# Altium project merci_finger.PrjPcb
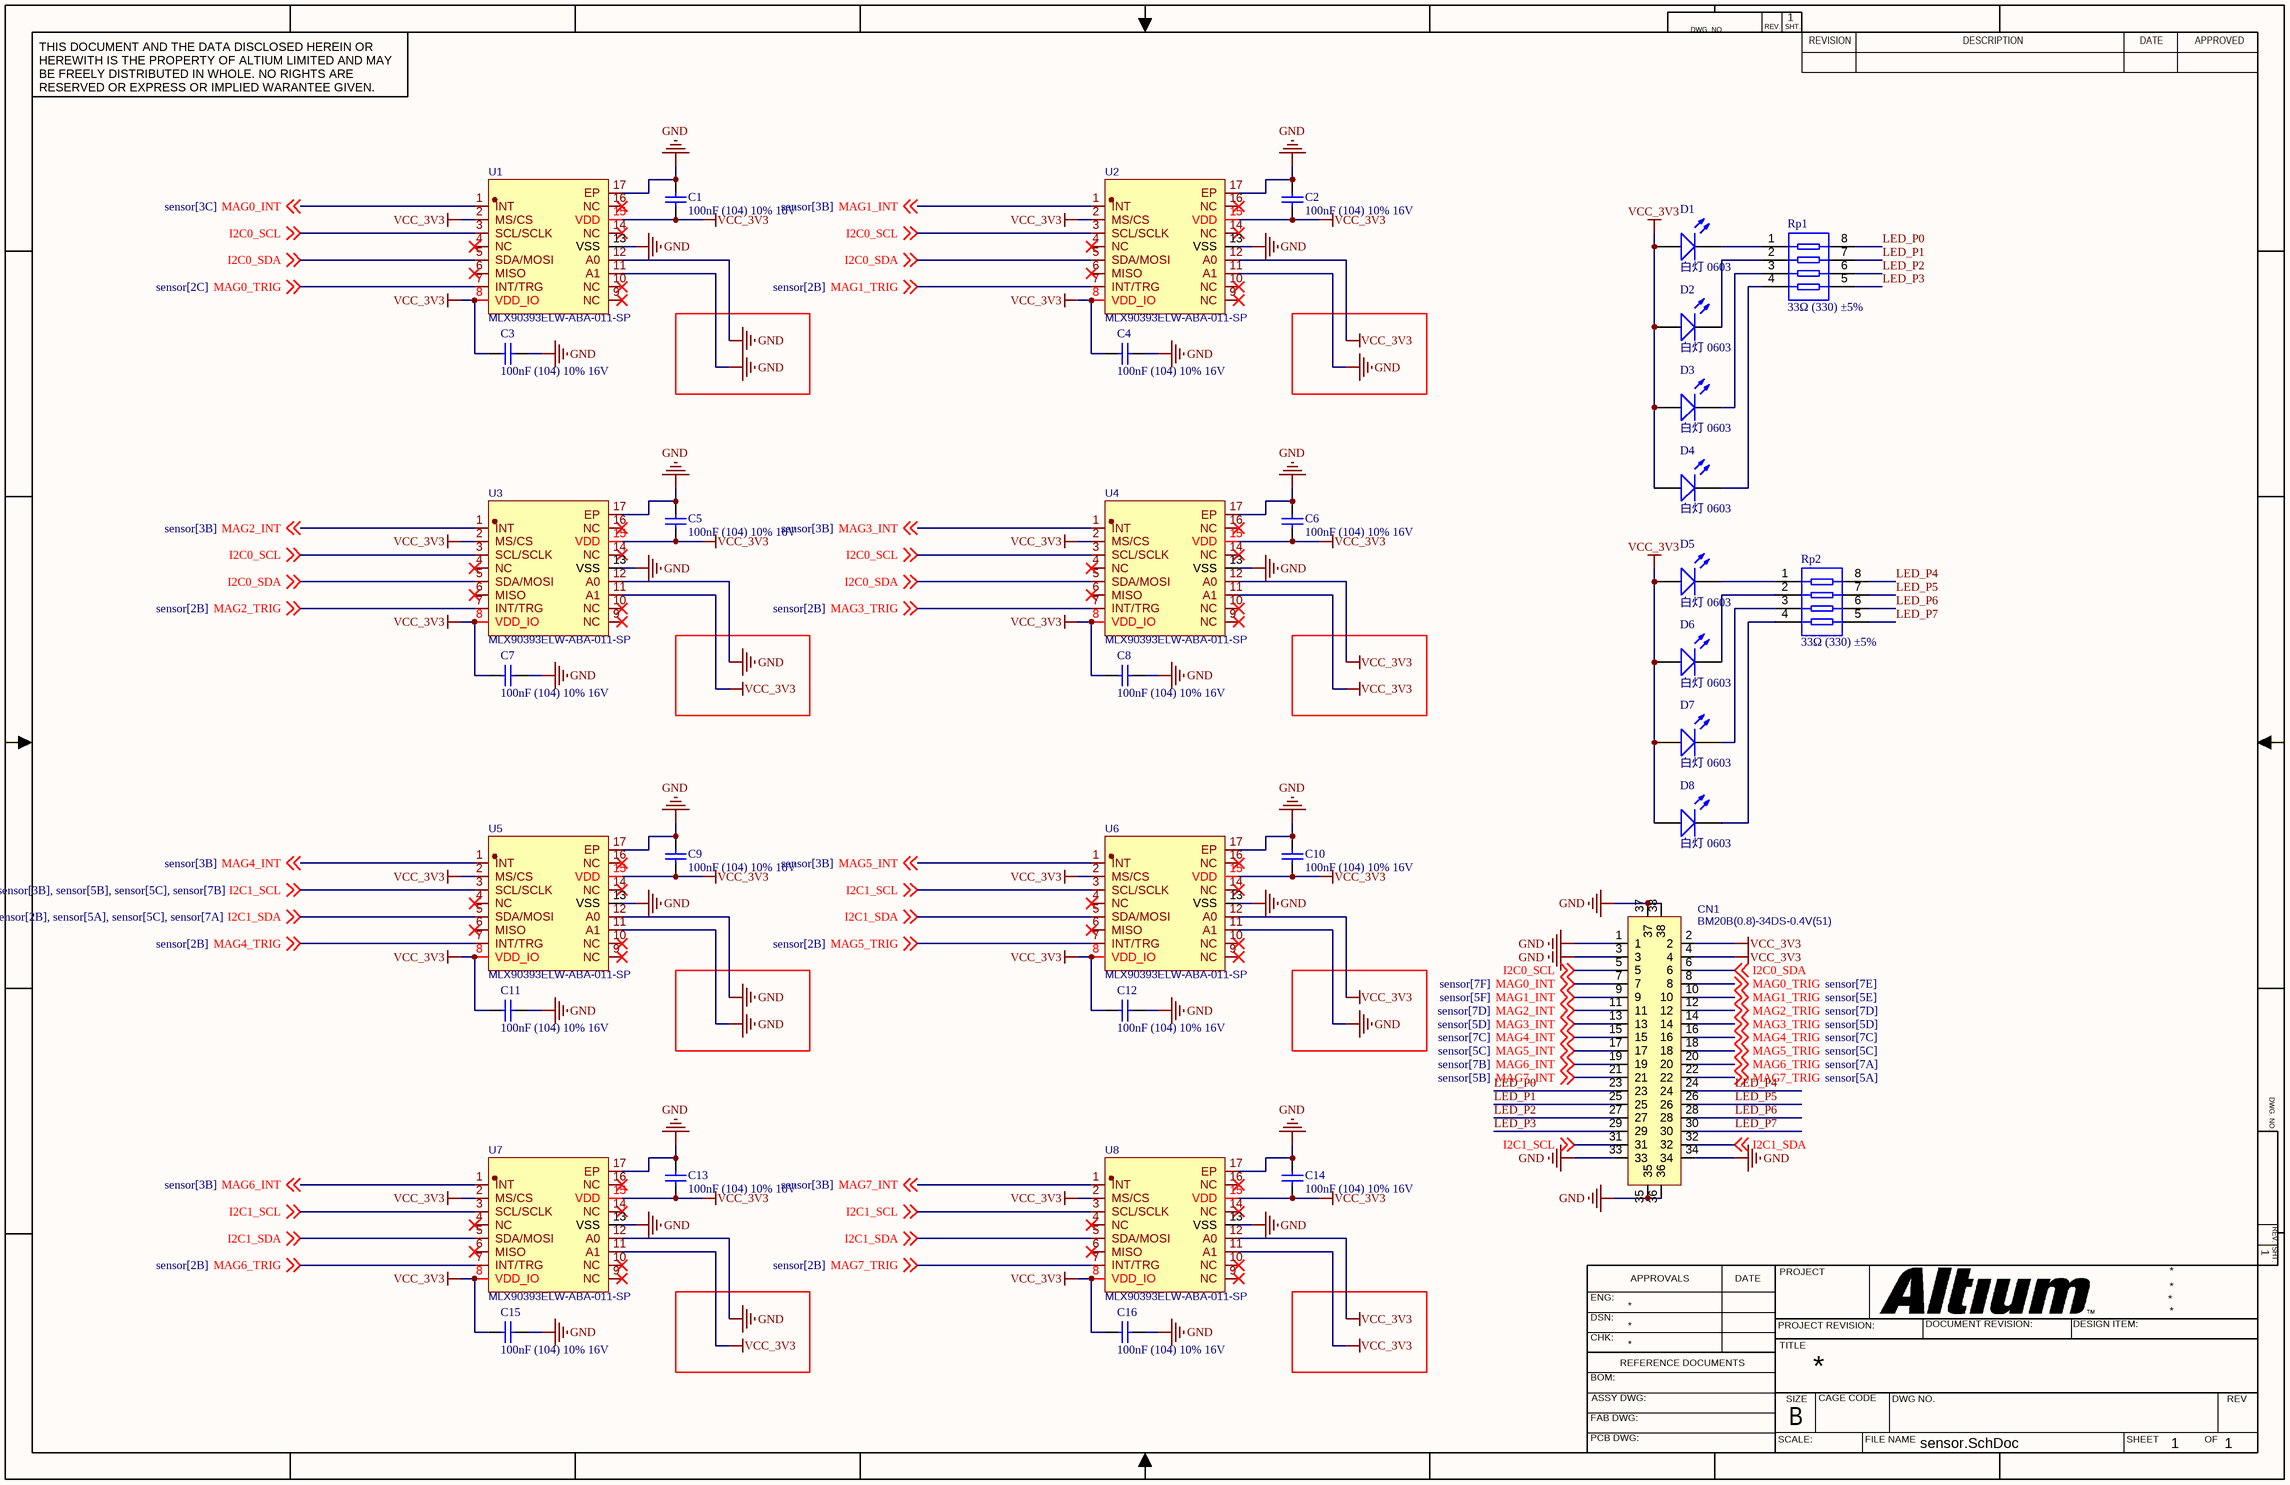
[diagram p0: sensor.SchDoc]
1 sheet, 35 parts. Net scope: global (net labels, ports and power ports of the same name join across sheets).
Board file: finger.PcbDoc

## Sheet sensor.SchDoc
size 431 x 279 mm; SheetNumber: 1; SheetTotal: 1

### Parts
C1  100nF (104) 10% 16V  [LC-0402_C_NOSILK]
C2  100nF (104) 10% 16V  [LC-0402_C_NOSILK]
C3  100nF (104) 10% 16V  [LC-0402_C_NOSILK]
C4  100nF (104) 10% 16V  [LC-0402_C_NOSILK]
C5  100nF (104) 10% 16V  [LC-0402_C_NOSILK]
C6  100nF (104) 10% 16V  [LC-0402_C_NOSILK]
C7  100nF (104) 10% 16V  [LC-0402_C_NOSILK]
C8  100nF (104) 10% 16V  [LC-0402_C_NOSILK]
C9  100nF (104) 10% 16V  [LC-0402_C_NOSILK]
C10  100nF (104) 10% 16V  [LC-0402_C_NOSILK]
C11  100nF (104) 10% 16V  [LC-0402_C_NOSILK]
C12  100nF (104) 10% 16V  [LC-0402_C_NOSILK]
C13  100nF (104) 10% 16V  [LC-0402_C_NOSILK]
C14  100nF (104) 10% 16V  [LC-0402_C_NOSILK]
C15  100nF (104) 10% 16V  [LC-0402_C_NOSILK]
C16  100nF (104) 10% 16V  [LC-0402_C_NOSILK]
CN1  BM20B(0.8)-34DS-0.4V(51)  [CONN-SMD_34P-P0.40_BM20B-0.8-34DS-0.4V-51]
D1  白灯 0603  [0603_LED_S1]
D2  白灯 0603  [0603_LED_S1]
D3  白灯 0603  [0603_LED_S1]
D4  白灯 0603  [0603_LED_S1]
D5  白灯 0603  [0603_LED_S1]
D6  白灯 0603  [0603_LED_S1]
D7  白灯 0603  [0603_LED_S1]
D8  白灯 0603  [0603_LED_S1]
Rp1  33Ω (330) ±5%  [0402_Rx4]
Rp2  33Ω (330) ±5%  [0402_Rx4]
U1  MLX90393ELW-ABA-011-SP  [QFN-16_L3.0-W3.0-P0.50-TR-EP1.7]
U2  MLX90393ELW-ABA-011-SP  [QFN-16_L3.0-W3.0-P0.50-TR-EP1.7]
U3  MLX90393ELW-ABA-011-SP  [QFN-16_L3.0-W3.0-P0.50-TR-EP1.7]
U4  MLX90393ELW-ABA-011-SP  [QFN-16_L3.0-W3.0-P0.50-TR-EP1.7]
U5  MLX90393ELW-ABA-011-SP  [QFN-16_L3.0-W3.0-P0.50-TR-EP1.7]
U6  MLX90393ELW-ABA-011-SP  [QFN-16_L3.0-W3.0-P0.50-TR-EP1.7]
U7  MLX90393ELW-ABA-011-SP  [QFN-16_L3.0-W3.0-P0.50-TR-EP1.7]
U8  MLX90393ELW-ABA-011-SP  [QFN-16_L3.0-W3.0-P0.50-TR-EP1.7]

### Nets
GND: C1.2 C2.2 C3.2 C4.2 C5.2 C6.2 C7.2 C8.2 C9.2 C10.2 C11.2 C12.2 C13.2 C14.2 C15.2 C16.2 CN1.1 CN1.3 CN1.33 CN1.34 CN1.35 CN1.36 CN1.37 CN1.38 U1.11(A1) U1.12(A0) U1.13(VSS) U1.17(EP) U2.11(A1) U2.13(VSS) U2.17(EP) U3.12(A0) U3.13(VSS) U3.17(EP) U4.13(VSS) U4.17(EP) U5.11(A1) U5.12(A0) U5.13(VSS) U5.17(EP) U6.11(A1) U6.13(VSS) U6.17(EP) U7.12(A0) U7.13(VSS) U7.17(EP) U8.13(VSS) U8.17(EP)
VCC_3V3: C1.1 C2.1 C3.1 C4.1 C5.1 C6.1 C7.1 C8.1 C9.1 C10.1 C11.1 C12.1 C13.1 C14.1 C15.1 C16.1 CN1.2 CN1.4 D1.A D2.A D3.A D4.A D5.A D6.A D7.A D8.A U1.2(MS/CS) U1.8(VDD_IO) U1.15(VDD) U2.2(MS/CS) U2.8(VDD_IO) U2.12(A0) U2.15(VDD) U3.2(MS/CS) U3.8(VDD_IO) U3.11(A1) U3.15(VDD) U4.2(MS/CS) U4.8(VDD_IO) U4.11(A1) U4.12(A0) U4.15(VDD) U5.2(MS/CS) U5.8(VDD_IO) U5.15(VDD) U6.2(MS/CS) U6.8(VDD_IO) U6.12(A0) U6.15(VDD) U7.2(MS/CS) U7.8(VDD_IO) U7.11(A1) U7.15(VDD) U8.2(MS/CS) U8.8(VDD_IO) U8.11(A1) U8.12(A0) U8.15(VDD)
I2C0_SCL: CN1.5 U1.3(SCL/SCLK) U2.3(SCL/SCLK) U3.3(SCL/SCLK) U4.3(SCL/SCLK) ; off-sheet I2C0_SCL
I2C0_SDA: CN1.6 U1.5(SDA/MOSI) U2.5(SDA/MOSI) U3.5(SDA/MOSI) U4.5(SDA/MOSI) ; off-sheet I2C0_SDA
I2C1_SCL: CN1.31 U5.3(SCL/SCLK) U6.3(SCL/SCLK) U7.3(SCL/SCLK) U8.3(SCL/SCLK) ; off-sheet I2C1_SCL
I2C1_SDA: CN1.32 U5.5(SDA/MOSI) U6.5(SDA/MOSI) U7.5(SDA/MOSI) U8.5(SDA/MOSI) ; off-sheet I2C1_SDA
LED_P0: CN1.23 Rp1.8
LED_P1: CN1.25 Rp1.7
LED_P2: CN1.27 Rp1.6
LED_P3: CN1.29 Rp1.5
LED_P4: CN1.24 Rp2.8
LED_P5: CN1.26 Rp2.7
LED_P6: CN1.28 Rp2.6
LED_P7: CN1.30 Rp2.5
MAG0_INT: CN1.7 U1.1(INT) ; off-sheet MAG0_INT
MAG0_TRIG: CN1.8 U1.7(INT/TRG) ; off-sheet MAG0_TRIG
MAG1_INT: CN1.9 U2.1(INT) ; off-sheet MAG1_INT
MAG1_TRIG: CN1.10 U2.7(INT/TRG) ; off-sheet MAG1_TRIG
MAG2_INT: CN1.11 U3.1(INT) ; off-sheet MAG2_INT
MAG2_TRIG: CN1.12 U3.7(INT/TRG) ; off-sheet MAG2_TRIG
MAG3_INT: CN1.13 U4.1(INT) ; off-sheet MAG3_INT
MAG3_TRIG: CN1.14 U4.7(INT/TRG) ; off-sheet MAG3_TRIG
MAG4_INT: CN1.15 U5.1(INT) ; off-sheet MAG4_INT
MAG4_TRIG: CN1.16 U5.7(INT/TRG) ; off-sheet MAG4_TRIG
MAG5_INT: CN1.17 U6.1(INT) ; off-sheet MAG5_INT
MAG5_TRIG: CN1.18 U6.7(INT/TRG) ; off-sheet MAG5_TRIG
MAG6_INT: CN1.19 U7.1(INT) ; off-sheet MAG6_INT
MAG6_TRIG: CN1.20 U7.7(INT/TRG) ; off-sheet MAG6_TRIG
MAG7_INT: CN1.21 U8.1(INT) ; off-sheet MAG7_INT
MAG7_TRIG: CN1.22 U8.7(INT/TRG) ; off-sheet MAG7_TRIG
NetD1_K: D1.K Rp1.1
NetD2_K: D2.K Rp1.2
NetD3_K: D3.K Rp1.3
NetD4_K: D4.K Rp1.4
NetD5_K: D5.K Rp2.1
NetD6_K: D6.K Rp2.2
NetD7_K: D7.K Rp2.3
NetD8_K: D8.K Rp2.4

Not connected (* = marked no-connect by the designer): U1 4(NC)* 6(MISO)* 9(NC)* 10(NC)* 14(NC)* 16(NC)*; U2 4(NC)* 6(MISO)* 9(NC)* 10(NC)* 14(NC)* 16(NC)*; U3 4(NC)* 6(MISO)* 9(NC)* 10(NC)* 14(NC)* 16(NC)*; U4 4(NC)* 6(MISO)* 9(NC)* 10(NC)* 14(NC)* 16(NC)*; U5 4(NC)* 6(MISO)* 9(NC)* 10(NC)* 14(NC)* 16(NC)*; U6 4(NC)* 6(MISO)* 9(NC)* 10(NC)* 14(NC)* 16(NC)*; U7 4(NC)* 6(MISO)* 9(NC)* 10(NC)* 14(NC)* 16(NC)*; U8 4(NC)* 6(MISO)* 9(NC)* 10(NC)* 14(NC)* 16(NC)*

### Notes on the sheet
- DWG. NO.
- REV.
- SHT.
- THIS DOCUMENT AND THE DATA DISCLOSED HEREIN OR HEREWITH IS THE PROPERTY OF ALTIUM LIMITED AND MAY BE FREELY DISTRIBUTED IN WHOLE. NO RIGHTS ARE RESERVED OR EXPRESS OR IMPLIED WARANTEE GIVEN.
- REVISION
- DESCRIPTION
- DATE
- APPROVED
- ENG:
- APPROVALS
- PROJECT
- DSN:
- CHK:
- REFERENCE DOCUMENTS
- PROJECT REVISION:
- TITLE
- DOCUMENT REVISION:
- DESIGN ITEM:
- BOM:
- FAB DWG:
- PCB DWG:
- ASSY DWG:
- SCALE:
- SIZE
- B
- CAGE CODE
- FILE NAME
- DWG NO.
- SHEET
- OF
- REV

### Library data of the parts
C1-C16 = 0402 100nF (104) 10% 16V: 贴片电容; ComponentLink1Description: 供应商链接; ComponentLink1URL: http://www.szlcsc.com/product/details_1877.html; Package: 0402; Supplier: LC; SuppliersPartNumber: C1525
CN1 = BM20B(0.8)-34DS-0.4V(51): 0.4mm BTB连接器-34P 母; BOM_Manufacturer: HRS(广濑); Contributor: LCSC; BOM_Supplier: LCSC; BOM_Supplier Part: C424541; BOM_Manufacturer Part: BM20B(0.8)-34DS-0.4V(51); BOM_JLCPCB Part Class: Extended Part; spicePre: C; spiceSymbolName: BM20B(0.8)-34DS-0.4V(51)
D1-D8 = 0603 白灯: 发光二极管; ComponentLink1Description: 供应商链接; ComponentLink1URL: http://www.szlcsc.com/product/details_2663.html; Package: 0603; Supplier: LC; SuppliersPartNumber: C2290
Rp1 Rp2 = 0402*4 33Ω (330) 5%: 贴片排阻; ComponentLink1Description: 供应商链接; ComponentLink1URL: http://www.szlcsc.com/product/details_26244.html; Package: 0402*4; Supplier: LC; SuppliersPartNumber: C25501
U1-U8 = MLX90393ELW-ABA-011-SP: BOM_Manufacturer: Melexis(比利时迈来芯); Contributor: LCSC; BOM_Supplier: LCSC; BOM_Supplier Part: C1526586; BOM_Manufacturer Part: MLX90393ELW-ABA-011-SP; BOM_JLCPCB Part Class: Extended Part; spicePre: U; spiceSymbolName: MLX90393ELW-ABA-011-SP